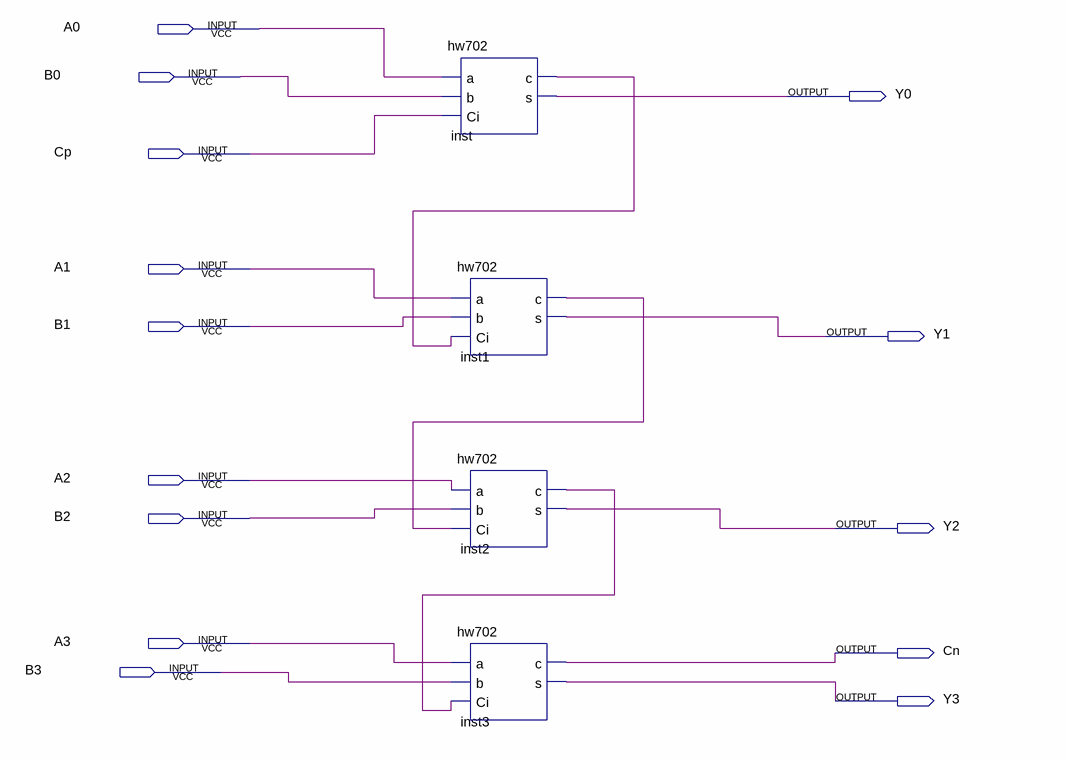
[diagram p0: schematic sheet]
// Quartus schematic HW703.bdf as structural Verilog: 4 symbols, 14 pins
module HW703 (
  input  A0,
  input  B0,
  input  Cp,
  input  A1,
  input  B1,
  input  A2,
  input  B2,
  input  A3,
  input  B3,
  output Y0,
  output Y1,
  output Y2,
  output Cn,
  output Y3
);

  wire inst1_c, inst2_c, inst_c;

  hw702 inst (.a(A0), .b(B0), .Ci(Cp), .c(inst_c), .s(Y0));
  hw702 inst1 (.a(A1), .b(B1), .Ci(inst_c), .c(inst1_c), .s(Y1));
  hw702 inst2 (.a(A2), .b(B2), .Ci(inst1_c), .c(inst2_c), .s(Y2));
  hw702 inst3 (.a(A3), .b(B3), .Ci(inst2_c), .c(Cn), .s(Y3));
endmodule
